# EAGLE design untitled (EAGLE 9.6.2)
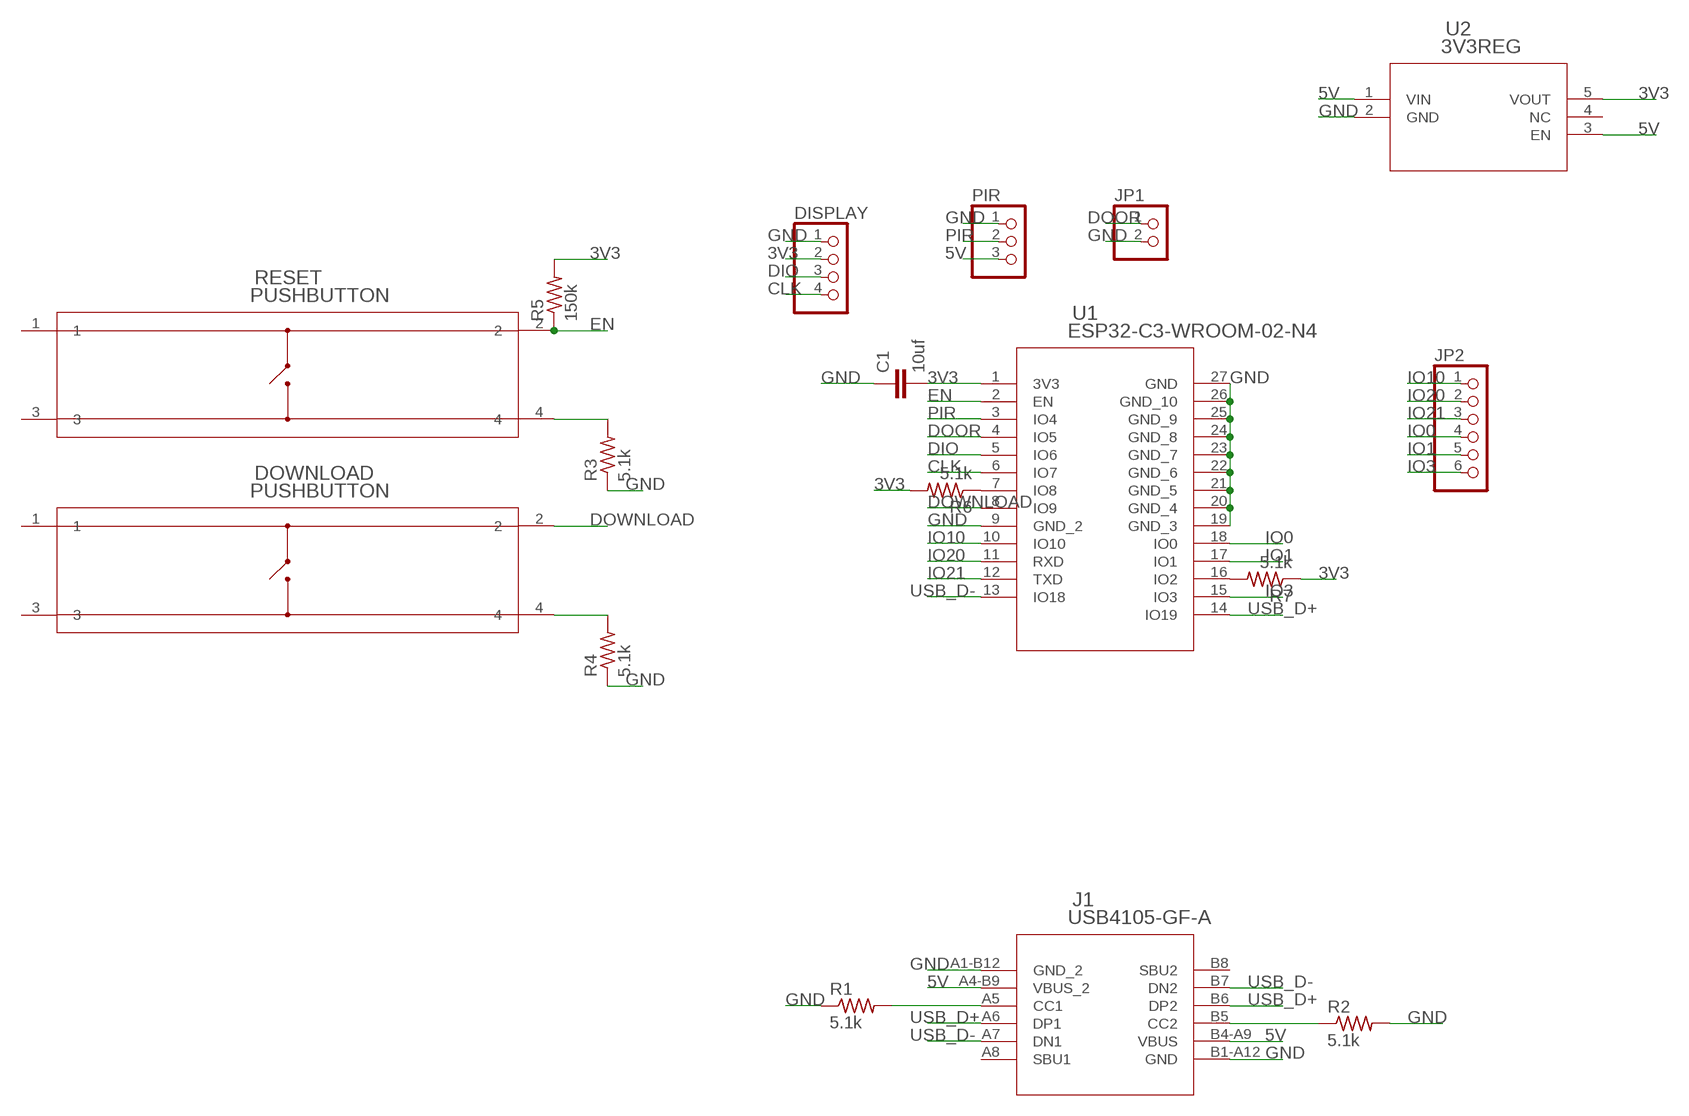
[diagram p0: schematic, sheet 1]

## Parts
C1  10uf  C-EUC0805  [C0805]
DISPLAY  PINHD-1X4  [1X04]
DOWNLOAD  PUSHBUTTON  [SW4_PTS815_SJM_250_SMTR_LFS_CN]
J1  USB4105-GF-A  [USB4105_GCT]
JP1  PINHD-1X2  [1X02]
JP2  PINHD-1X6  [1X06]
PIR  PINHD-1X3  [1X03]
R1  5.1k  R-US_R0603  [R0603]
R2  5.1k  R-US_R0603  [R0603]
R3  5.1k  R-US_R0603  [R0603]
R4  5.1k  R-US_R0603  [R0603]
R5  150k  R-US_R0603  [R0603]
R6  5.1k  R-US_R0603  [R0603]
R7  5.1k  R-US_R0603  [R0603]
RESET  PUSHBUTTON  [SW4_PTS815_SJM_250_SMTR_LFS_CN]
U1  ESP32-C3-WROOM-02-N4  [IC18_ESP32-C3-WROOM-02-N4_EXP]
U2  3V3REG  [SOT_RG1_DIO]

## Nets
3V3: C1.2 DISPLAY.2 R5.2 R6.2 R7.1 U1.1(3V3) U2.5(VOUT)
5V: J1.A4-B9(VBUS_2) J1.B4-A9(VBUS) PIR.3 U2.1(VIN) U2.3(EN)
CLK: DISPLAY.4 U1.6(IO7)
DIO: DISPLAY.3 U1.5(IO6)
DOOR: JP1.1 U1.4(IO5)
DOWNLOAD: DOWNLOAD.2 U1.8(IO9)
EN: R5.1 RESET.2 U1.2(EN)
GND: C1.1 DISPLAY.1 J1.A1-B12(GND_2) J1.B1-A12(GND) JP1.2 PIR.1 R1.1 R2.2 R3.1 R4.1 U1.9(GND_2) U1.19(GND_3) U1.20(GND_4) U1.21(GND_5) U1.22(GND_6) U1.23(GND_7) U1.24(GND_8) U1.25(GND_9) U1.26(GND_10) U1.27(GND) U2.2(GND)
IO0: JP2.4 U1.18(IO0)
IO1: JP2.5 U1.17(IO1)
IO3: JP2.6 U1.15(IO3)
IO10: JP2.1 U1.10(IO10)
IO20: JP2.2 U1.11(RXD)
IO21: JP2.3 U1.12(TXD)
N$1: R6.1 U1.7(IO8)
N$2: R7.2 U1.16(IO2)
N$3: J1.A5(CC1) R1.2
N$5: DOWNLOAD.4 R4.2
N$8: J1.B5(CC2) R2.1
N$42: R3.2 RESET.4
PIR: PIR.2 U1.3(IO4)
USB_D+: J1.A6(DP1) J1.B6(DP2) U1.14(IO19)
USB_D-: J1.A7(DN1) J1.B7(DN2) U1.13(IO18)
Unconnected: DOWNLOAD.1 DOWNLOAD.3 J1.A8(SBU1) J1.B8(SBU2) RESET.1 RESET.3 U2.4(NC)

## Library data of the parts
C1 = rcl:C-EU: CAPACITOR, European symbol; SPICEPREFIX: C
DISPLAY = pinhead:PINHD-1X4: PIN HEADER
DOWNLOAD RESET = components:PUSHBUTTON; COPYRIGHT: Copyright (C) 2023 Ultra Librarian. All rights reserved.; DIGIKEY_PART_NUMBER_1: CKN12215-2-ND; DIGIKEY_PART_NUMBER_2: CKN12215-1-ND; DIGIKEY_PART_NUMBER_3: CKN12215-6-ND; MANUFACTURER_PART_NUMBER: PTS815 SJM 250 SMTR LFS; MFR_NAME: C&K Components
J1 = components:USB4105-GF-A; COPYRIGHT: Copyright (C) 2023 Ultra Librarian. All rights reserved.; DIGIKEY_PART_NUMBER_1: 2073-USB4105-GF-ACT-ND; DIGIKEY_PART_NUMBER_2: 2073-USB4105-GF-ADKR-ND; DIGIKEY_PART_NUMBER_3: 2073-USB4105-GF-ATR-ND; MANUFACTURER_PART_NUMBER: USB4105-GF-A; MFR_NAME: Global Connector Technology
JP1 = pinhead:PINHD-1X2: PIN HEADER
JP2 = pinhead:PINHD-1X6: PIN HEADER
PIR = pinhead:PINHD-1X3: PIN HEADER
R1-R7 = rcl:R-US_: RESISTOR, American symbol; SPICEPREFIX: R
U1 = components:ESP32-C3-WROOM-02-N4; COPYRIGHT: Copyright (C) 2023 Ultra Librarian. All rights reserved.; DIGIKEY_PART_NUMBER_1: 1965-ESP32-C3-WROOM-02-N4TR-ND; DIGIKEY_PART_NUMBER_2: 1965-ESP32-C3-WROOM-02-N4CT-ND; DIGIKEY_PART_NUMBER_3: 1965-ESP32-C3-WROOM-02-N4DKR-ND; MANUFACTURER_PART_NUMBER: ESP32-C3-WROOM-02-N4; MFR_NAME: Espressif Systems
U2 = components:3V3REG; COPYRIGHT: Copyright (C) 2023 Ultra Librarian. All rights reserved.; DIGIKEY_PART_NUMBER_1: AP2112K-3.3TRG1DICT-ND; DIGIKEY_PART_NUMBER_2: AP2112K-3.3TRG1DIDKR-ND; DIGIKEY_PART_NUMBER_3: AP2112K-3.3TRG1DITR-ND; MANUFACTURER_PART_NUMBER: AP2112K-3.3TRG1; MFR_NAME: Diodes Inc

## Board
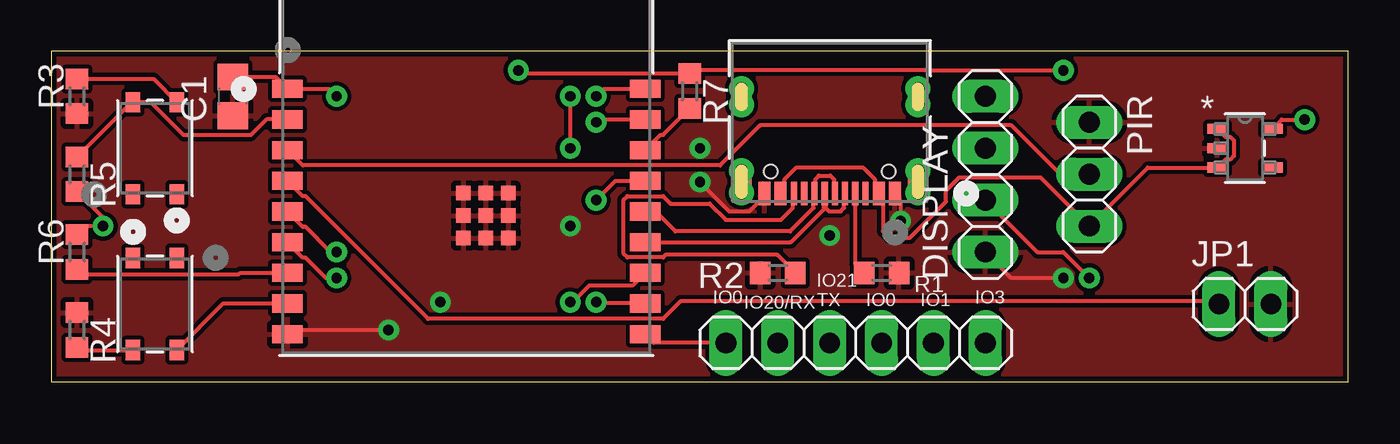
[diagram p1: board, top side]
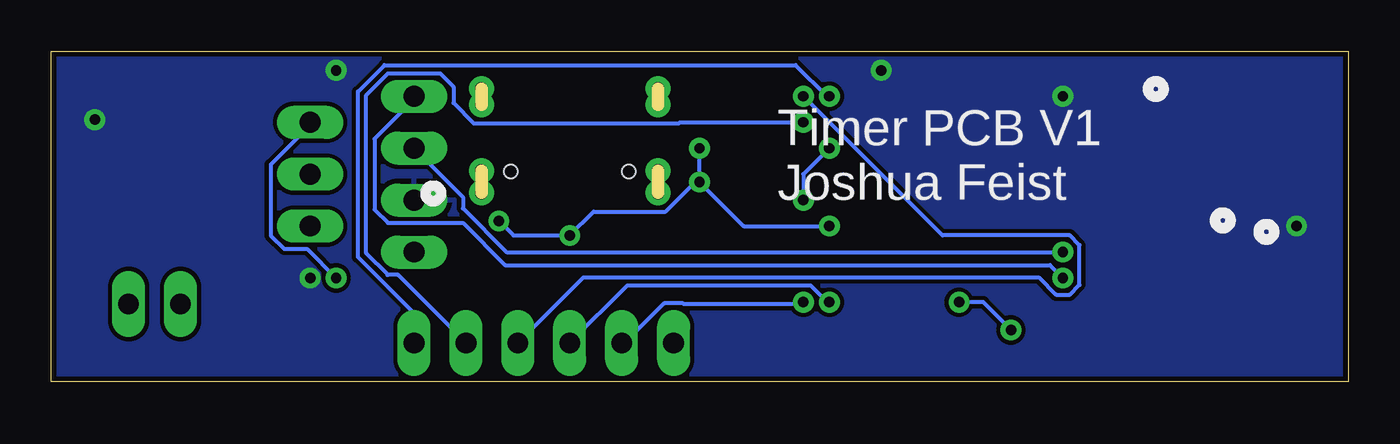
[diagram p2: board, bottom side, seen from below]

Size 63.48 x 16.18 mm. Coordinates in mm from the lower left corner, seen from the top.
Outline: 0,0 63.48,0 63.48,16.18 0,16.18 0,0
Copper layers (1*16): Top 0.035mm / dielectric 1.5mm / Bottom 0.035mm
Design rules "SparkFun": minimum track width 8mil, minimum drill 20mil, track to track 8mil, track to pad 8mil, pad to pad 8mil, via to via 8mil, smd to smd 8mil, copper to edge 10mil, drill to drill 8mil, minimum pad ring 12mil, minimum via ring 10mil, stop-mask expansion 4mil, vias tented up to drill 25mil, thermal gap 10mil

### Footprints (pad centres in the part's own frame; a part is rotated, then mirrored left to right if it is on the bottom)
C0805 = smd 1.3 x 1.5: 1 -0.95,0; 2 0.95,0
1X04 = drill 1.016 long: 1 -3.81,0; 2 -1.27,0; 3 1.27,0; 4 3.81,0
SW4_PTS815_SJM_250_SMTR_LFS_CN = smd 0.991 x 0.711: 1 -2.25,1.075; 2 2.25,1.075; 3 -2.25,-1.075; 4 2.25,-1.075
USB4105_GCT = smd 0.991 x 1.803: 13 -4.32,-1.269; 14 4.32,-1.269 | smd 0.991 x 2.108: 15 -4.32,2.911; 16 4.32,2.911 | smd 0.584 x 1.143: A1-B12 -3.2,3.486; A4-B9 -2.4,3.486; B1-A12 3.2,3.486; B4-A9 2.4,3.486 | smd 0.305 x 1.143: A5 -1.25,3.486; A6 -0.25,3.486; A7 0.25,3.486; A8 1.25,3.486; B5 1.75,3.486; B6 0.75,3.486; B7 -0.75,3.486; B8 -1.75,3.486 | drill 0.61 pad 0.61: S_1_H1 -4.318,-0.864; S_1_H2 -4.318,-1.651; S_2_H1 4.318,-0.864; S_2_H2 4.318,-1.651; S_3_H1 -4.318,3.454; S_3_H2 -4.318,2.362; S_4_H1 4.318,3.454; S_4_H2 4.318,2.362 | hole 0.66: 2.896,2.413; -2.896,2.413
1X02 = drill 1.016 long: 1 -1.27,0; 2 1.27,0
1X06 = drill 1.016 long: 1 -6.35,0; 2 -3.81,0; 3 -1.27,0; 4 1.27,0; 5 3.81,0; 6 6.35,0
1X03 = drill 1.016 long: 1 -2.54,0; 2 0,0; 3 2.54,0
R0603 = smd 1 x 1.1: 1 -0.85,0; 2 0.85,0
IC18_ESP32-C3-WROOM-02-N4_EXP = smd 1.499 x 0.889: 1 -8.75,2.905; 2 -8.75,1.405; 3 -8.75,-0.095; 4 -8.75,-1.595; 5 -8.75,-3.095; 6 -8.75,-4.595; 7 -8.75,-6.095; 8 -8.75,-7.595; 9 -8.75,-9.095; 10 8.75,-9.095; 11 8.75,-7.595; 12 8.75,-6.095; 13 8.75,-4.595; 14 8.75,-3.095; 15 8.75,-1.595; 16 8.75,-0.095; 17 8.75,1.405; 18 8.75,2.905 | smd 0.711 x 0.711: 19 -0.144,-2.195; 20 0.956,-2.195; 21 2.056,-2.195; 22 -0.144,-3.295; 23 0.956,-3.295; 24 2.056,-3.295; 25 -0.144,-4.395; 26 0.956,-4.395; 27 2.056,-4.395
SOT_RG1_DIO = smd 1.003 x 0.508: 1 -1.353,0.95; 2 -1.353,0; 3 -1.353,-0.95; 4 1.353,-0.95; 5 1.353,0.95

### Placement (x,y rotation side)
C1  8.89,13.97 90 top
DISPLAY  45.72,10.16 90 top
DOWNLOAD  5.08,3.81 270 top
J1  38.1,12.7 180 top
JP1  58.42,3.81 0 top
JP2  39.37,1.91 0 top
PIR  50.8,10.16 270 top
R1  40.64,5.33 180 top
R2  35.56,5.33 180 top
R3  1.27,13.97 90 top
R4  1.27,2.54 270 top
R5  1.27,10.16 270 top
R6  1.27,6.35 90 top
R7  31.24,14.22 270 top
RESET  5.08,11.43 90 top
U1  20.32,11.43 0 top
U2  58.42,11.43 0 top

### Tracks (layer width: path | path; a pad name or v marks a point on that pad's centre or on a via)
3V3  (via drill 0.51)
  Top 0.203: U2.5 60.22,12.83 v61.34,12.83 | v13.97,13.97 13.6,14.34 U1.1 10.99,14.92 C1.2 | R5.2 2.54,8.04 v2.54,7.62 1.69,7.62 R6.2 | DISPLAY.2 48.26,6.35 49.53,6.35 v50.8,5.08 | v22.86,15.24 23.02,15.08 29.95,15.08 29.96,15.07 R7.1 31.43,15.27 42.8,15.27 42.82,15.24 v49.53,15.24
  pour Bottom: 0,16.51 63.5,16.51 63.5,0 0,0
5V
  Top 0.203: U2.1 57.46,11.99 57.7,11.99 57.87,11.81 57.87,11.05 57.7,10.87 57.46,10.87 U2.3 53.66,10.48 PIR.3 48.41,10.01 44.44,10.01 43.79,9.35 43.79,8.82 42.04,7.06 41.02,7.06 40.7,7.37 40.7,9.01 J1.A4-B9 40.31,9.41 40.31,9.91 39.72,10.5 36.48,10.5 35.89,9.91 35.89,9.41 J1.B4-A9
CLK  (via drill 0.51)
  Top 0.203: U1.6 12.32,6.08 12.45,6.08 13.45,5.08 v13.97,5.08
  Bottom 0.203: v13.97,5.08 14.6,5.72 41.26,5.72 43.32,7.77 47,7.77 47.65,8.43 47.65,11.89 45.72,13.82 DISPLAY.4
DIO  (via drill 0.51)
  Top 0.203: U1.5 12.32,7.58 12.45,7.58 13.68,6.35 v13.97,6.35
  Bottom 0.203: DISPLAY.3 43.33,9.04 43.33,8.49 41.2,6.35 v13.97,6.35
DOOR
  Top 0.203: U1.4 12.32,9.08 12.45,9.08 18.44,3.09 29.95,3.09 30.8,3.94 57.02,3.94 JP1.1
DOWNLOAD
  Top 0.203: DOWNLOAD.2 8.43,3.84 U1.8
EN
  Top 0.203: R5.1 3.94,13.68 RESET.2 4.87,13.68 6.49,12.07 9.77,12.07 10.54,12.84 U1.2
GND  (via drill 0.51)
  Top 0.203: J1.B1-A12 34.7,9.01 34.7,8.87 34.16,8.33 33.19,8.33 v31.75,9.77 | J1.A1-B12 41.5,9.01 41.5,8.87 41.57,8.8 v41.57,7.87 | U1.9 11.77,2.54 v16.51,2.54 | v49.53,5.08 46.99,5.08 DISPLAY.1
  Bottom 0.203: v31.75,9.77 v31.75,11.43 | v41.57,7.87 40.86,7.16 v38.1,7.16 36.93,8.33 33.4,8.33 31.96,9.77 v31.75,9.77 | v16.51,2.54 17.87,3.9 v19.05,3.9 | v31.75,9.77 29.6,7.62 v25.4,7.62 | PIR.1 50.8,12.55 52.73,10.62 52.73,7.16 52.08,6.5 50.95,6.5 v49.53,5.08
  pour Top: 0,16.51 63.5,16.51 63.5,0 0,0
IO0  (via drill 0.51)
  Top 0.203: v26.67,13.97 27.04,14.34 U1.18
  Bottom 0.203: JP2.4 37.43,5.12 15.16,5.12 14.31,4.27 13.63,4.27 13.16,4.74 13.16,6.69 13.63,7.16 19.86,7.16 v26.67,13.97
IO1  (via drill 0.51)
  Top 0.203: v26.67,12.7 26.8,12.84 U1.17
  Bottom 0.203: JP2.5 46.51,5.23 46.99,5.23 47,5.23 | 47,5.23 47.02,5.23 | v26.67,12.7 32.71,12.7 32.76,12.65 42.8,12.65 43.79,13.64 43.79,14.43 44.44,15.09 47,15.09 48.06,14.03 48.06,6.29 47,5.23
IO3  (via drill 0.51)
  Top 0.203: v25.4,13.97 v25.4,11.43 | v26.67,8.89 27.62,9.84 U1.15
  Bottom 0.203: v25.4,13.97 25.52,13.97 27.04,15.49 47.16,15.49 48.46,14.2 48.46,10.16 48.46,10.1 48.46,6.1 45.72,3.36 JP2.6 | v25.4,11.43 26.67,10.16 v26.67,8.89
IO10
  Top 0.203: JP2.1 29.5,1.91 U1.10
IO20  (via drill 0.51)
  Top 0.203: U1.11 26.73,3.84 v26.67,3.9
  Bottom 0.203: v26.67,3.9 26.67,3.81 32.53,3.81 32.56,3.84 33.48,3.84 35.41,1.91 JP2.2
IO21  (via drill 0.51)
  Top 0.203: v25.4,3.9 25.52,3.9 26.33,4.71 28.45,4.71 U1.12
  Bottom 0.203: v25.4,3.9 25.49,3.9 26.3,4.71 35.29,4.71 JP2.3
N$1
  Top 0.203: U1.7 9.25,5.34 9.18,5.26 1.51,5.26 R6.1
N$2
  Top 0.203: U1.16 29.82,12.09 29.95,12.09 R7.2
N$3
  Top 0.203: R1.2 39.35,5.77 J1.A5
N$5
  Top 0.203: R4.2 1.4,1.56 DOWNLOAD.4
N$8
  Top 0.203: R2.1 35.53,6.21 30.07,6.21 29.95,6.09 28.19,6.09 28.02,6.26 28.02,8.91 28.19,9.08 29.95,9.08 30.31,8.72 32.23,8.72 33.02,7.93 35.71,7.93 36.3,8.52 36.3,9.16 J1.B5
N$42
  Top 0.203: R3.2 5.02,14.82 RESET.4
PIR
  Top 0.203: PIR.2 49.38,10.16 47,12.55 34.7,12.55 32.74,10.59 12.32,10.59 U1.3
USB_D+
  Top 0.203: J1.A6 38.31,9.26 38.31,9.91 38.13,10.09 37.57,10.09 37.39,9.91 37.39,9.26 J1.B6 37.31,9.17 37.31,8.52 36.16,7.37 30.55,7.37 29.58,8.34 U1.14
USB_D-
  Top 0.203: U1.13 36.2,6.84 37.81,8.44 37.81,9.17 J1.A7 37.89,9.17 37.89,8.52 38.07,8.34 38.63,8.34 38.81,8.52 38.81,9.17 J1.B7

### Text on the board
tPlace: IO0 | IO21 / TX | IO0 | IO1 | IO3 | IO20/RX
bPlace: Timer PCB V1 / Joshua Feist